# Altium schematic sheet Haptic Drivers.SchDoc
size A; SheetNumber: 7; SheetTotal: 7
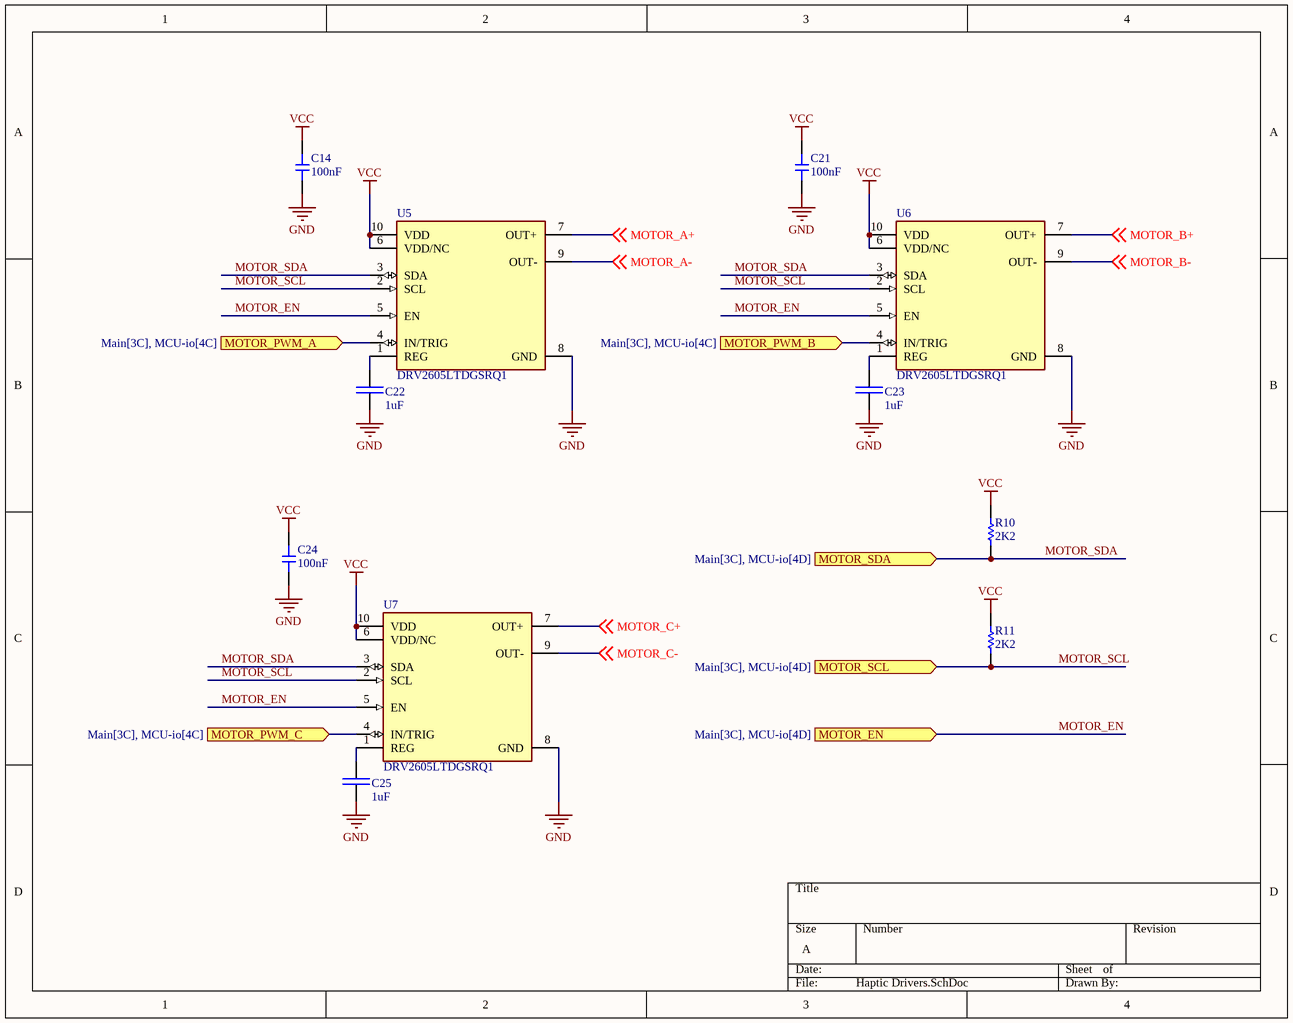
[diagram p0: Haptic Drivers.SchDoc]

## Parts
C14  Capacitance: 100nF  [CAP-0603]  (hidden comment: CC0603KRX7R9BB104)
C21  Capacitance: 100nF  [CAP-0603]  (hidden comment: CC0603KRX7R9BB104)
C22  1uF  [CAP_SM0603_YAGEOCC2_N]
C23  1uF  [CAP_SM0603_YAGEOCC2_N]
C24  Capacitance: 100nF  [CAP-0603]  (hidden comment: CC0603KRX7R9BB104)
C25  1uF  [CAP_SM0603_YAGEOCC2_N]
R10  2K2  [RES_SM0603_YAGEORC_N]
R11  2K2  [RES_SM0603_YAGEORC_N]
U5  DRV2605LTDGSRQ1  [FP-DGS0010A-IPC_B]
U6  DRV2605LTDGSRQ1  [FP-DGS0010A-IPC_B]
U7  DRV2605LTDGSRQ1  [FP-DGS0010A-IPC_B]

## Ports
MOTOR_EN (in, see Main[3C], MCU-io[4D]), MOTOR_PWM_A (in, see Main[3C], MCU-io[4C]), MOTOR_PWM_B (in, see Main[3C], MCU-io[4C]), MOTOR_PWM_C (in, see Main[3C], MCU-io[4C]), MOTOR_SCL (in, see Main[3C], MCU-io[4D]), MOTOR_SDA (in, see Main[3C], MCU-io[4D])

## Nets
GND: C14.1 C21.1 C22.2 C23.2 C24.1 C25.2 U5.8(GND) U6.8(GND) U7.8(GND)
VCC: C14.2 C21.2 C24.2 R10.2 R11.2 U5.6(VDD/NC) U5.10(VDD) U6.6(VDD/NC) U6.10(VDD) U7.6(VDD/NC) U7.10(VDD)
MOTOR_A+: U5.7(OUT+) ; off-sheet MOTOR_A+
MOTOR_A-: U5.9(OUT-) ; off-sheet MOTOR_A-
MOTOR_B+: U6.7(OUT+) ; off-sheet MOTOR_B+
MOTOR_B-: U6.9(OUT-) ; off-sheet MOTOR_B-
MOTOR_C+: U7.7(OUT+) ; off-sheet MOTOR_C+
MOTOR_C-: U7.9(OUT-) ; off-sheet MOTOR_C-
MOTOR_EN: U5.5(EN) U6.5(EN) U7.5(EN) ; port MOTOR_EN
MOTOR_PWM_A: U5.4(IN/TRIG) ; port MOTOR_PWM_A
MOTOR_PWM_B: U6.4(IN/TRIG) ; port MOTOR_PWM_B
MOTOR_PWM_C: U7.4(IN/TRIG) ; port MOTOR_PWM_C
MOTOR_SCL: R11.1 U5.2(SCL) U6.2(SCL) U7.2(SCL) ; port MOTOR_SCL
MOTOR_SDA: R10.1 U5.3(SDA) U6.3(SDA) U7.3(SDA) ; port MOTOR_SDA
NetC22_1: C22.1 U5.1(REG)
NetC23_1: C23.1 U6.1(REG)
NetC25_1: C25.1 U7.1(REG)

## Library data of the parts
C14 C21 C24 = CC0603KRX7R9BB104: Capacitor, Ceramic (MLCC), 100nF, ±10%, 50V, X7R, ±10%, SMD 0603; Manufacturer: YAGEO; Package Size: 0603; JLCPCB Basic Part: Yes; JLCPCB Part Number: C14663; Supplier 1: LCSC; Category: Capacitors - MLCC; Supplier Part Number 1: C14663; Manufacturer Part Number: CC0603KRX7R9BB104; Tolerance: ±10%; Voltage Rating: 50V; Temperature Coefficient: X7R; RoHS: Yes; ComponentLink1Description: Datasheet; ComponentLink1URL: https://wmsc.lcsc.com/wmsc/upload/file/pdf/v2/lcsc/2211101700_YAGEO-CC0603KRX7R9BB104_C14663.pdf; ComponentLink2Description: JLCPCB Part URL; ComponentLink2URL: https://jlcpcb.com/partdetail/C14663; ComponentLink3Description: LCSC Part URL; ComponentLink3URL: https://lcsc.com/product-detail/Multilayer-Ceramic-Capacitors-MLCC---SMD-SMT_YAGEO-YAGEO-CC0603KRX7R9BB104_C14663.html
C22 C23 C25 = CC0603KRX7R9BB105: CAP 1uF SM0603 X7R 50V YAGEO CC2; Manufacturer Part Number: CC0603KRX7R9BB183; Tolerance (%): 10; Voltage Rating (Volts): 50; Category: Capacitor; Manufacturer: Yageo; Package: 0603; Value: 1uF; Supplier Part Number 1: 3019743; Supplier 1: Farnell; ComponentLink1URL: http://www.yageo.com; ComponentLink1Description: Manufacturer Website; Supplier 2: Digi-Key
R10 R11 = RC0603FR-072K2L: RES 2K2 SM0603 YAGEO RC_L; Power (Watts): 0.1; Resistance (Ohms): 2200; Tolerance (%): 1; Category: Resistor; Manufacturer: Yageo; Manufacturer Part Number: RC0603FR-072K2L; Package: 0603; Value: 2K2; Supplier Part Number 1: 9238522; Supplier 1: Farnell; ComponentLink1URL: http://www.yageo.com; ComponentLink1Description: Manufacturer Website; Supplier 2: Digi-Key; Supplier Part Number 2: 311-2.20KHRCT-ND
U5-U7 = CMP-04915-000035-1: IC MOTOR DRIVER 2V-5.2V 10VSSOP; Logic Function: AND GATE; Min Supply Voltage: 2V; Max Supply Voltage: 5.2V; Quiescent Current: 500uA; Interface: I2C; Min Operating Temperature: -40°C; RoHS Compliant: Yes; Max Operating Temperature: 105°C; Case/Package: VSSOP; REACH SVHC: No SVHC; Packaging: Cut Tape; Number of Pins: 10; Mount: Surface Mount; Lead Free: Lead Free